# EAGLE design GPRS_Tracker_Sensors (EAGLE 8.1.0)

## Sheet 1 of 5
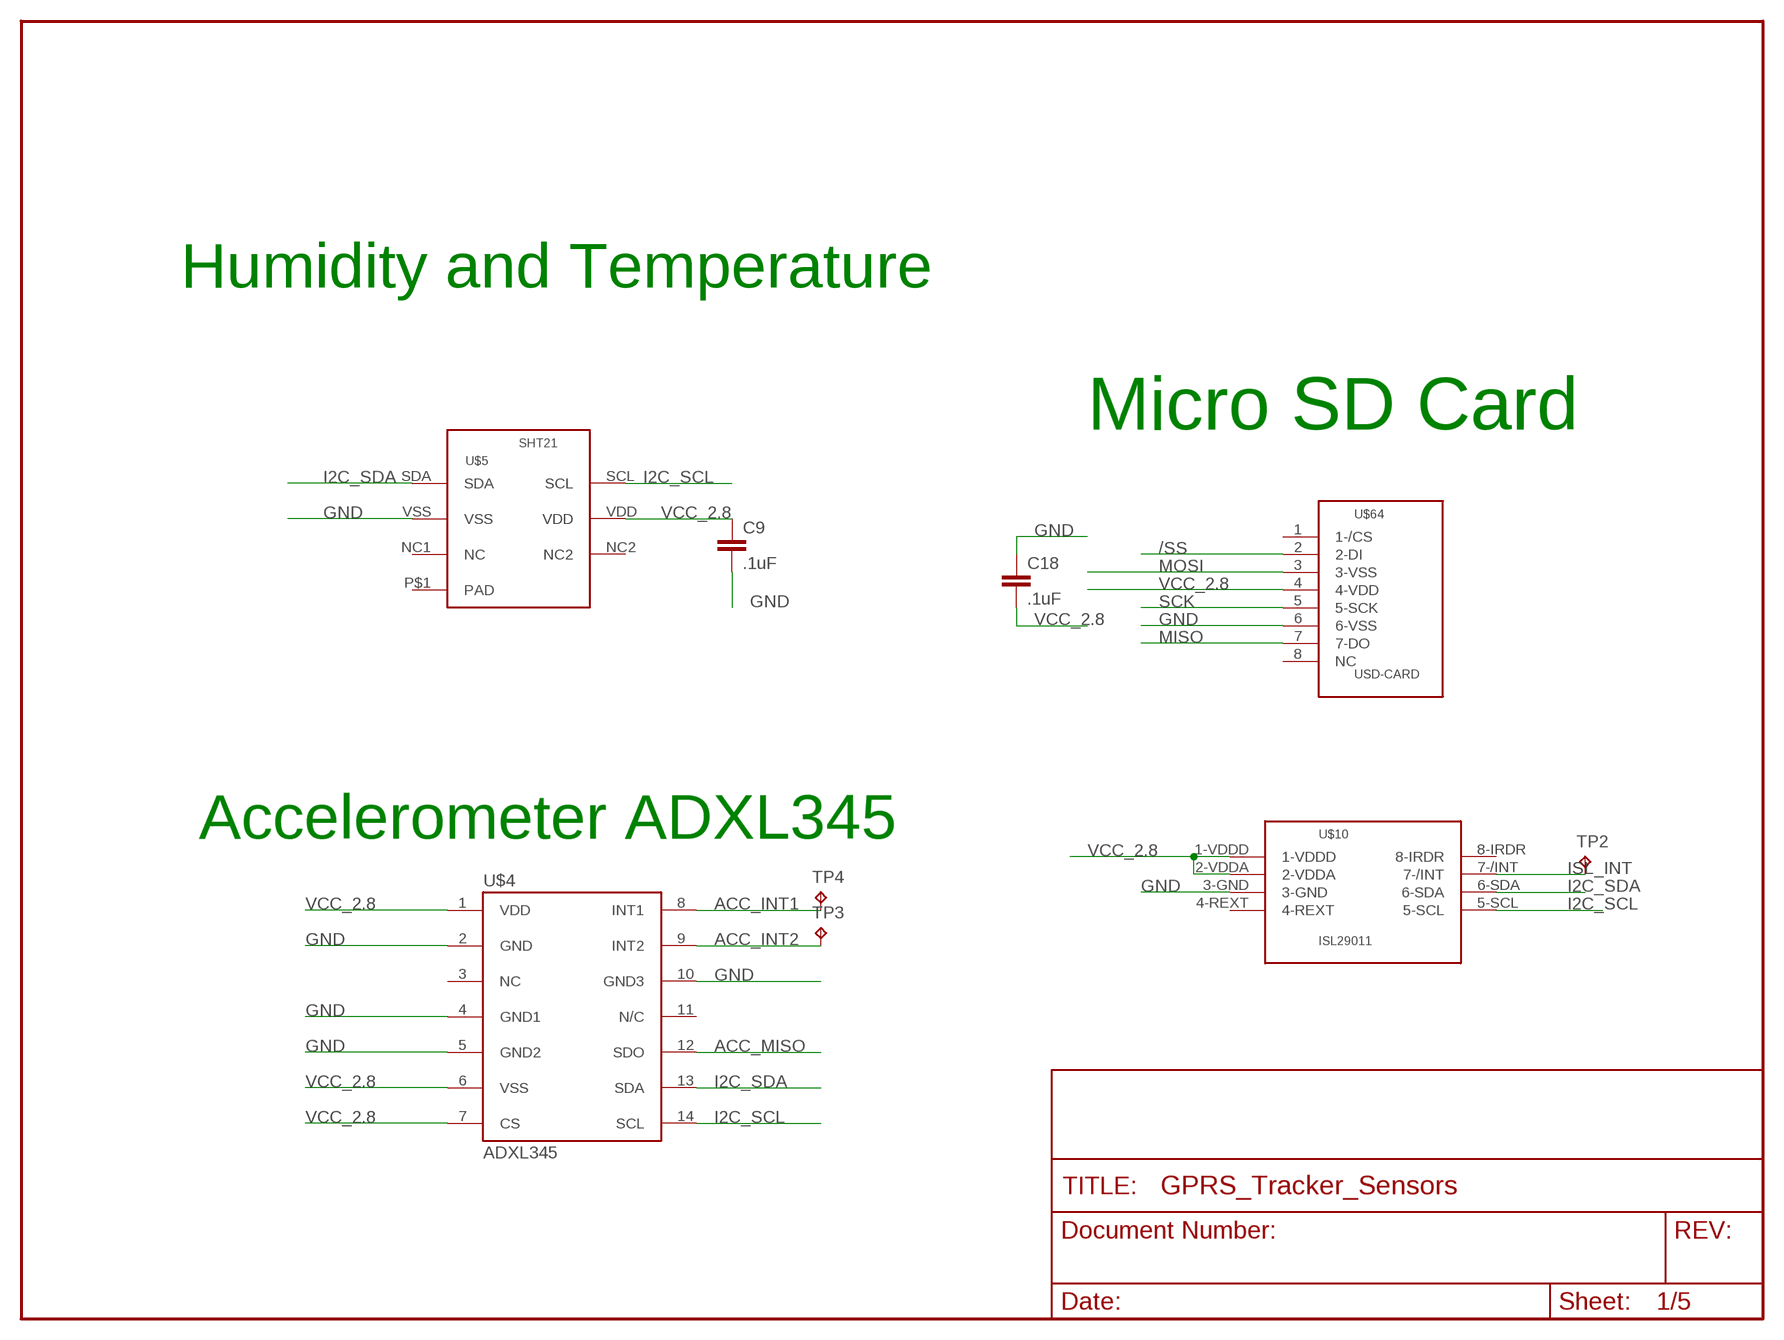
[diagram p0: schematic, sheet 1]

### Parts
C9  .1uF  C-EUC0402  [C0402]
C18  .1uF  C-EUC0402  [C0402]
TP2  TPTP08R  [TP08R]
TP3  TPTP06R  [TP06R]
TP4  TPTP06R  [TP06R]
U$4  ADXL345  [LGA14]
U$5  SHT21  [SHT21]
U$10  ISL29011  [ISL29011]
U$64  USD-CARD  [502774-0891]

### Nets
/SS: U$64.2(2-DI)
ACC_INT1: TP4.TP U$4.8(INT1)
ACC_INT2: TP3.TP U$4.9(INT2)
ACC_MISO: U$4.12(SDO)
GND: C9.2 C18.1 U$4.2(GND) U$4.4(GND1) U$4.5(GND2) U$4.10(GND3) U$5.VSS U$10.3-GND U$64.6(6-VSS) ; also sheet 2,5
I2C_SCL: U$4.14(SCL) U$5.SCL U$10.5-SCL
I2C_SDA: U$4.13(SDA) U$5.SDA U$10.6-SDA
ISL_INT: TP2.TP U$10.7-/INT
MISO: U$64.7(7-DO)
MOSI: U$64.3(3-VSS)
SCK: U$64.5(5-SCK)
VCC_2.8: C9.1 C18.2 U$4.1(VDD) U$4.6(VSS) U$4.7(CS) U$5.VDD U$10.1-VDDD U$10.2-VDDA U$64.4(4-VDD) ; also sheet 5
Unconnected: U$4.3(NC) U$4.11(N/C) U$5.NC1(NC) U$5.NC2 U$5.P$1(PAD) U$10.4-REXT U$10.8-IRDR U$64.1(1-/CS) U$64.8(NC)

### Notes on the sheet
- Humidity and Temperature
- Micro SD Card
- Accelerometer ADXL345

## Sheet 2 of 5
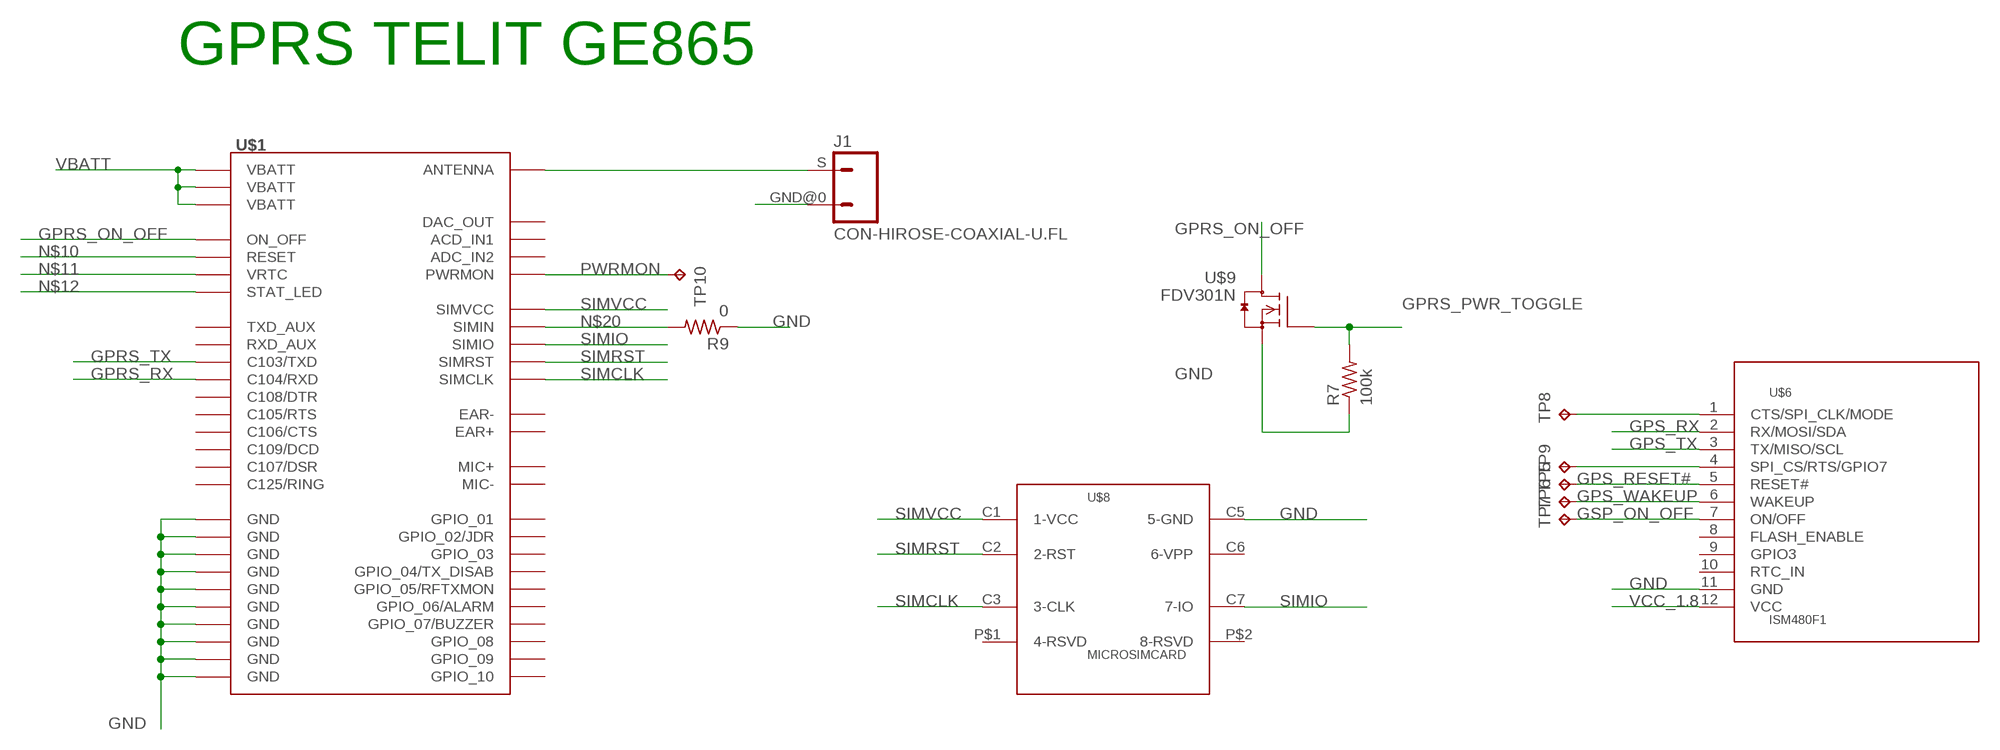
[diagram p1: schematic, sheet 2]

### Parts
J1  CON-HIROSE-COAXIAL-U.FL  [CON-U.FL]
R7  100k  R-US_R0402  [R0402]
R9  0  R-US_R0402  [R0402]
TP5  TPTP06R  [TP06R]
TP6  TPTP06R  [TP06R]
TP7  TPTP06R  [TP06R]
TP8  TPTP06R  [TP06R]
TP9  TPTP06R  [TP06R]
TP10  TPTP06R  [TP06R]
U$1  GE865  [GE865]
U$6  ISM480F1  [20488-012E-01]
U$8  MICROSIMCARD  [FMS006-5000-0]
U$9  FDV301N  [SOT23]

### Nets
GND: R7.1 R9.1 U$1.C2(GND) U$1.C7(GND) U$1.E5(GND) U$1.E7(GND) U$1.G1(GND) U$1.G3(GND) U$1.G4(GND) U$1.G5(GND) U$1.H3(GND) U$1.H6(GND) U$6.11(GND) U$8.C5(5-GND) U$9.2(S) ; also sheet 1,5
GPRS_ON_OFF: U$1.B1(ON_OFF) U$9.3(D)
GPRS_PWR_TOGGLE: R7.2 U$9.1(G)
GPRS_RX: U$1.A4(C104/RXD)
GPRS_TX: U$1.A3(C103/TXD)
GPS_RESET#: TP5.TP U$6.5(RESET#)
GPS_RX: U$6.2(RX/MOSI/SDA)
GPS_TX: U$6.3(TX/MISO/SCL)
GPS_WAKEUP: TP6.TP U$6.6(WAKEUP)
GSP_ON_OFF: TP7.TP U$6.7(ON/OFF)
N$7: J1.S U$1.H5(ANTENNA)
N$8: J1.GND@0
N$9: TP8.TP U$6.1(CTS/SPI_CLK/MODE)
N$10: U$1.C1(RESET)
N$11: U$1.H2(VRTC)
N$12: U$1.G8(STAT_LED)
N$13: TP9.TP U$6.4(SPI_CS/RTS/GPIO7)
N$20: R9.2 U$1.B7(SIMIN)
PWRMON: TP10.TP U$1.E2(PWRMON)
SIMCLK: U$1.A5(SIMCLK) U$8.C3(3-CLK)
SIMIO: U$1.A6(SIMIO) U$8.C7(7-IO)
SIMRST: U$1.A8(SIMRST) U$8.C2(2-RST)
SIMVCC: U$1.A7(SIMVCC) U$8.C1(1-VCC)
VBATT: U$1.F1(VBATT) U$1.F2(VBATT) U$1.F3(VBATT) ; also sheet 5
VCC_1.8: U$6.12(VCC) ; also sheet 5
Unconnected: U$1.A1(C105/RTS) U$1.A2(C106/CTS) U$1.B2(C107/DSR) U$1.B3(C108/DTR) U$1.B4(C125/RING) U$1.B5(C109/DCD) U$1.B8(MIC+) U$1.C8(MIC-) U$1.D1(TXD_AUX) U$1.D2(GPIO_02/JDR) U$1.D3(GPIO_01) U$1.D4(GPIO_08) U$1.D8(EAR+) U$1.E1(RXD_AUX) U$1.E3(GPIO_10) U$1.E4(GPIO_03) U$1.E8(EAR-) U$1.F4(GPIO_09) U$1.F5(ACD_IN1) U$1.F6(ADC_IN2) U$1.G2(GPIO_05/RFTXMON) U$1.G6(GPIO_07/BUZZER) U$1.G7(DAC_OUT) U$1.H7(GPIO_04/TX_DISAB) U$1.H8(GPIO_06/ALARM) U$6.8(FLASH_ENABLE) U$6.9(GPIO3) U$6.10(RTC_IN) U$8.C6(6-VPP) U$8.P$1(4-RSVD) U$8.P$2(8-RSVD)

### Notes on the sheet
- GPRS TELIT GE865

## Sheet 3 of 5

## Sheet 4 of 5

## Sheet 5 of 5
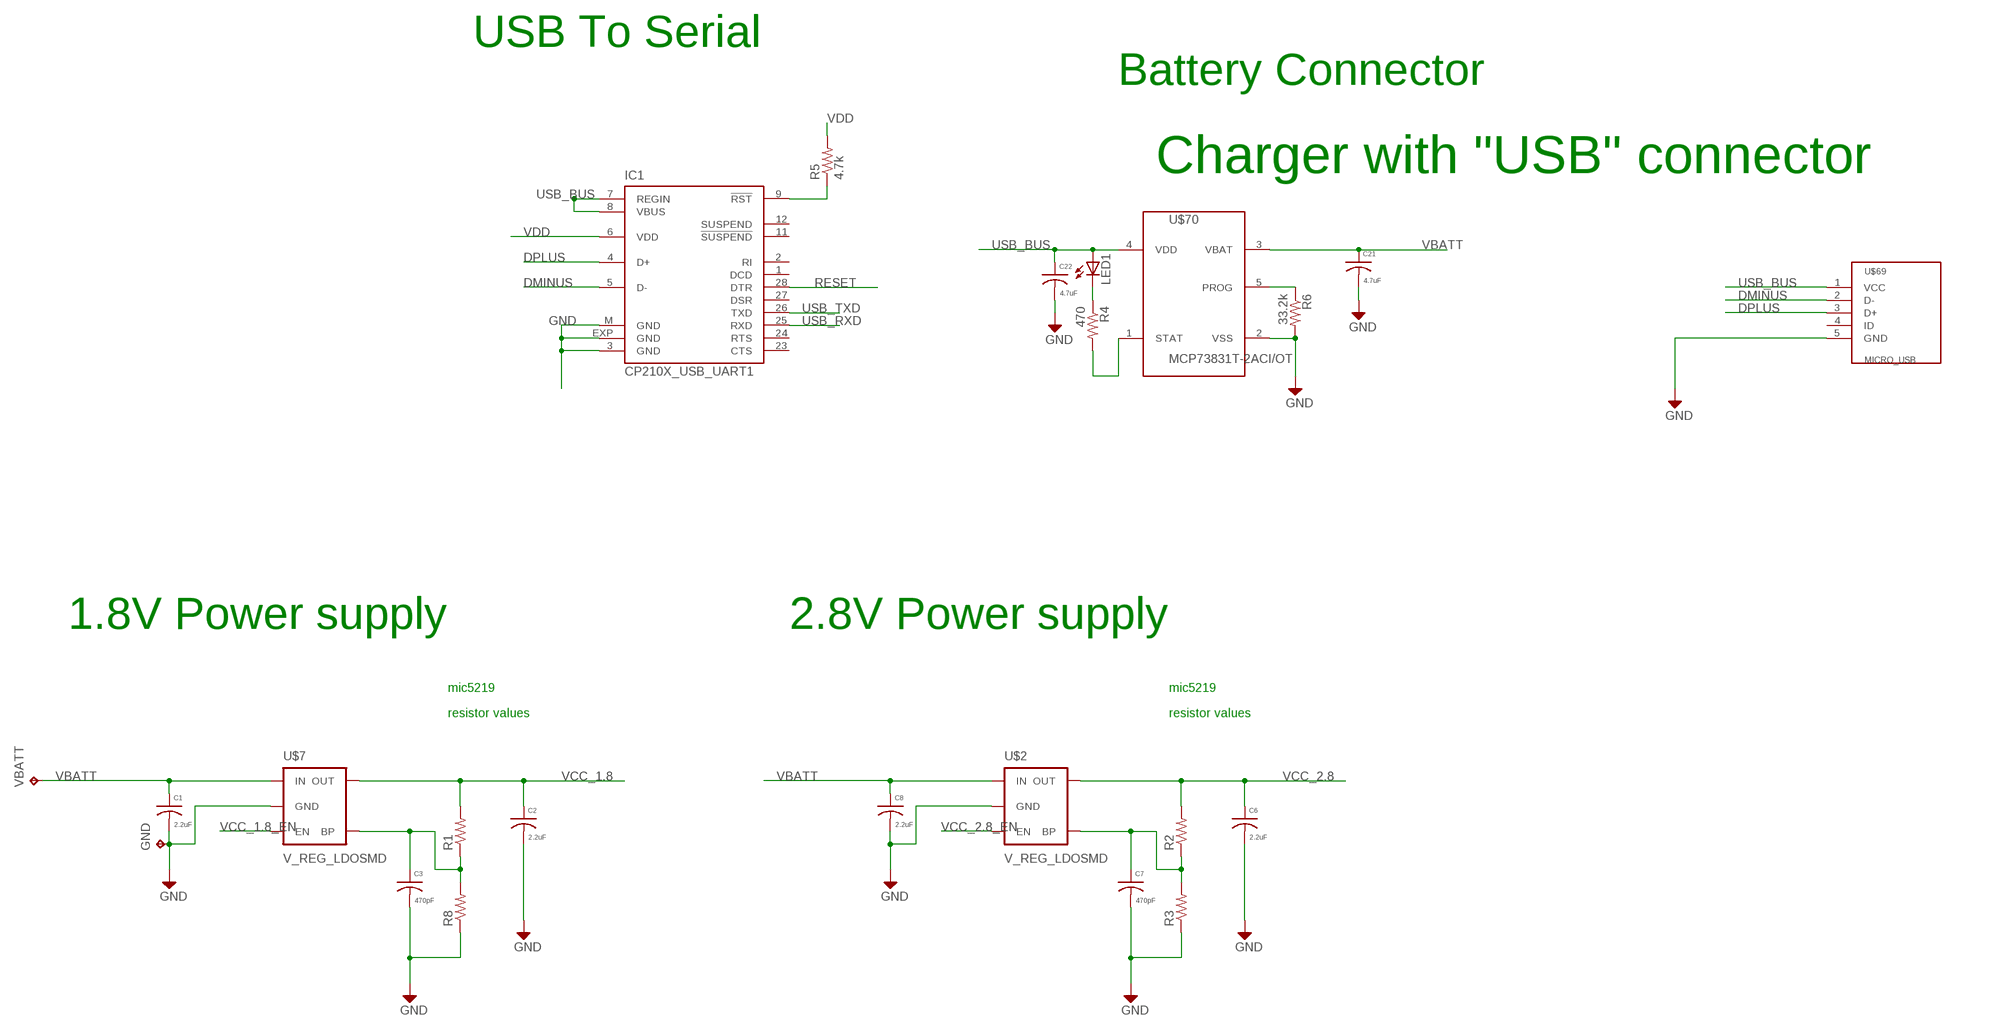
[diagram p2: schematic, sheet 5]

### Parts
C1  2.2uF  C0603  [C0603]
C2  2.2uF  C0603  [C0603]
C3  470pF  C0402  [C0402]
C6  2.2uF  C0603  [C0603]
C7  470pF  C0402  [C0402]
C8  2.2uF  C0603  [C0603]
C21  4.7uF  C0603  [C0603]
C22  4.7uF  C0603  [C0603]
GND  TPTP15R  [TP15R]
IC1  CP210X_USB_UART1  [MLP28]
LED1  LEDCHIP-LED0603  [CHIP-LED0603]
R1  R-US_R0402  [R0402]
R2  R-US_R0402  [R0402]
R3  R-US_R0402  [R0402]
R4  470  R-US_R0402  [R0402]
R5  4.7k  R-US_R0402  [R0402]
R6  33.2k  R-US_R0402  [R0402]
R8  R-US_R0402  [R0402]
U$2  V_REG_LDOSMD  [SOT23-5]
U$7  V_REG_LDOSMD  [SOT23-5]
U$69  MICRO_USB  [MICRO_USB]
U$70  MCP73831T-2ACI/OT  [SOT23-5L]
VBATT  TPTP15R  [TP15R]

### Nets
CHG_STAT: R4.2 U$70.1(STAT)
DMINUS: IC1.5(D-) U$69.2(D-)
DPLUS: IC1.4(D+) U$69.3(D+)
GND: C1.2 C2.2 C3.2 C6.2 C7.2 C8.2 C21.2 C22.2 GND.TP IC1.3(GND) IC1.EXP(GND) IC1.M(GND) R3.1 R6.2 R8.1 U$2.2(GND) U$7.2(GND) U$69.5(GND) U$70.2(VSS) ; also sheet 1,2
N$1: C3.1 R1.1 R8.2 U$7.4(BP)
N$2: C7.1 R2.1 R3.2 U$2.4(BP)
N$4: IC1.9(!RST) R5.1
N$40: LED1.C R4.1
N$41: R6.1 U$70.5(PROG)
RESET: IC1.28(DTR)
USB_BUS: C22.1 IC1.7(REGIN) IC1.8(VBUS) LED1.A U$69.1(VCC) U$70.4(VDD)
USB_RXD: IC1.25(RXD)
USB_TXD: IC1.26(TXD)
VBATT: C1.1 C8.1 C21.1 U$2.1(IN) U$7.1(IN) U$70.3(VBAT) VBATT.TP ; also sheet 2
VCC_1.8: C2.1 R1.2 U$7.5(OUT) ; also sheet 2
VCC_1.8_EN: U$7.3(EN)
VCC_2.8: C6.1 R2.2 U$2.5(OUT) ; also sheet 1
VCC_2.8_EN: U$2.3(EN)
VDD: IC1.6(VDD) R5.2
Unconnected: IC1.1(DCD) IC1.2(RI) IC1.11(!SUSPEND) IC1.12(SUSPEND) IC1.23(CTS) IC1.24(RTS) IC1.27(DSR) U$69.4(ID)

### Notes on the sheet
- USB To Serial
- Battery Connector
- Charger with "USB" connector
- 1.8V Power supply | 2.8V Power supply
- mic5219 | mic5219
- resistor values | resistor values

## Library data of the parts
C1-C3 C6-C8 C21 C22 = qualified_1:C
C9 C18 = rcl:C-EU: CAPACITOR, European symbol
GND TP2-TP10 VBATT = testpad:TP: Test pad
IC1 = SparkFun-3-2-07:CP210X_USB_UART: Single-Chip USB to UART Bridge Source: www.silabs.com .. CP2101.pdf / cp2102.pdf. Spark Fun Electronics SKU : IC-CP2102
J1 = m-pad-2.1:CON-HIROSE-COAXIAL: Hirose SMT 50 ohm impedance connector W.FL ............................. 1.4mm mated height, ultra small SMT connectors .................................. DC to 3GHz U.FL .............................. 1.9mm or 2.4mm mated height, ultra small SMT connectors ................... DC to 6GHz E.FL ............................... 3.2mm mated height, ultra small SMT connectors .................................. DC to 2GHz H.FL .............................. 3.0mm mated height, ultra small SMT connectors ................................... DC to 3GHz S.FL. ............................. 6.0mm mated height, SMT connectors ................................................... DC to 2.5GHz FL ................................. 10.5mm mated height, SMT connectors .................................................. DC to 1.5GHz Please send any comments to: messi@users.sourceforge.net
LED1 = led:LED: LED OSRAM: - CHIPLED LG R971, LG N971, LY N971, LG Q971, LY Q971, LO R971, LY R971 LH N974, LH R974 LS Q976, LO Q976, LY Q976 LO Q996 - Hyper CHIPLED LW Q18S LB Q993, LB Q99A, LB R99A - SideLED LS A670, LO A670, LY A670, LG A670, LP A670 LB A673, LV A673, LT A673, LW A673 LH A674 LY A675 LS A676, LA A676, LO A676, LY A676, LW A676 LS A679, LY A679, LG A679 - Hyper Micro SIDELED® LS Y876, LA Y876, LO Y876, LY Y876 LT Y87S - SmartLED LW L88C, LW L88S LB L89C, LB L89S, LG L890 LS L89K, LO L89K, LY L89K LS L896, LA L896, LO L896, LY L896 - TOPLED LS T670, LO T670, LY T670, LG T670, LP T670 LSG T670, LSP T670, LSY T670, LOP T670, LYG T670 LG T671, LOG T671, LSG T671 LB T673, LV T673, LT T673, LW T673 LH T674 LS T676, LA T676, LO T676, LY T676, LB T676, LH T676, LSB T676, LW T676 LB T67C, LV T67C, LT T67C, LS T67K, LO T67K, LY T67K, LW E67C LS E67B, LA E67B, LO E67B, LY E67B, LB E67C, LV E67C, LT E67C LW T67C LS T679, LY T679, LG T679 LS T770, LO T770, LY T770, LG T770, LP T770 LB T773, LV T773, LT T773, LW T773 LH T774 LS E675, LA E675, LY E675, LS T675 LS T776, LA T776, LO T776, LY T776, LB T776 LHGB T686 LT T68C, LB T68C - Hyper Mini TOPLED® LB M676 - Mini TOPLED Santana® LG M470 LS M47K, LO M47K, LY M47K Source: http://www.osram.convergy.de LUXEON: - LUMILED® LXK2-PW12-R00, LXK2-PW12-S00, LXK2-PW14-U00, LXK2-PW14-V00 LXK2-PM12-R00, LXK2-PM12-S00, LXK2-PM14-U00 LXK2-PE12-Q00, LXK2-PE12-R00, LXK2-PE12-S00, LXK2-PE14-T00, LXK2-PE14-U00 LXK2-PB12-K00, LXK2-PB12-L00, LXK2-PB12-M00, LXK2-PB14-N00, LXK2-PB14-P00, LXK2-PB14-Q00 LXK2-PR12-L00, LXK2-PR12-M00, LXK2-PR14-Q00, LXK2-PR14-R00 LXK2-PD12-Q00, LXK2-PD12-R00, LXK2-PD12-S00 LXK2-PH12-R00, LXK2-PH12-S00 LXK2-PL12-P00, LXK2-PL12-Q00, LXK2-PL12-R00 Source: www.luxeon.com KINGBRIGHT: KA-3528ASYC Source: www.kingbright.com
R1-R6 R8 = rcl:R-US_: RESISTOR, American symbol
R7 R9 = resistor:R-US_: RESISTOR, American symbol
U$1 = SparkFun:GE865
U$2 U$7 = SparkFun-3-2-07:V_REG_LDO: Voltage Regulator LDO Standard 150mA LDO voltage regulator in SOT-23 layout. Micrel part MIC5205. BP (by-pass) pin is used to lower output noise with 470pF cap.
U$4 = SparkFun:ADXL345
U$5 = m-pad-2.1:SHT21
U$6 = m-pad-2.1:ISM480F1
U$8 = m-pad-2.1:MICROSIMCARD
U$9 = m-pad-2.1:FDV301N
U$10 = m-pad-2.1:ISL29011
U$64 = m-pad-2.1:USD-CARD
U$69 = camera_project:MICRO_USB
U$70 = m-pad-2.1:MCP73831T-2ACI/OT

## Net classes
1 supply: width 0.229 mm

## Board
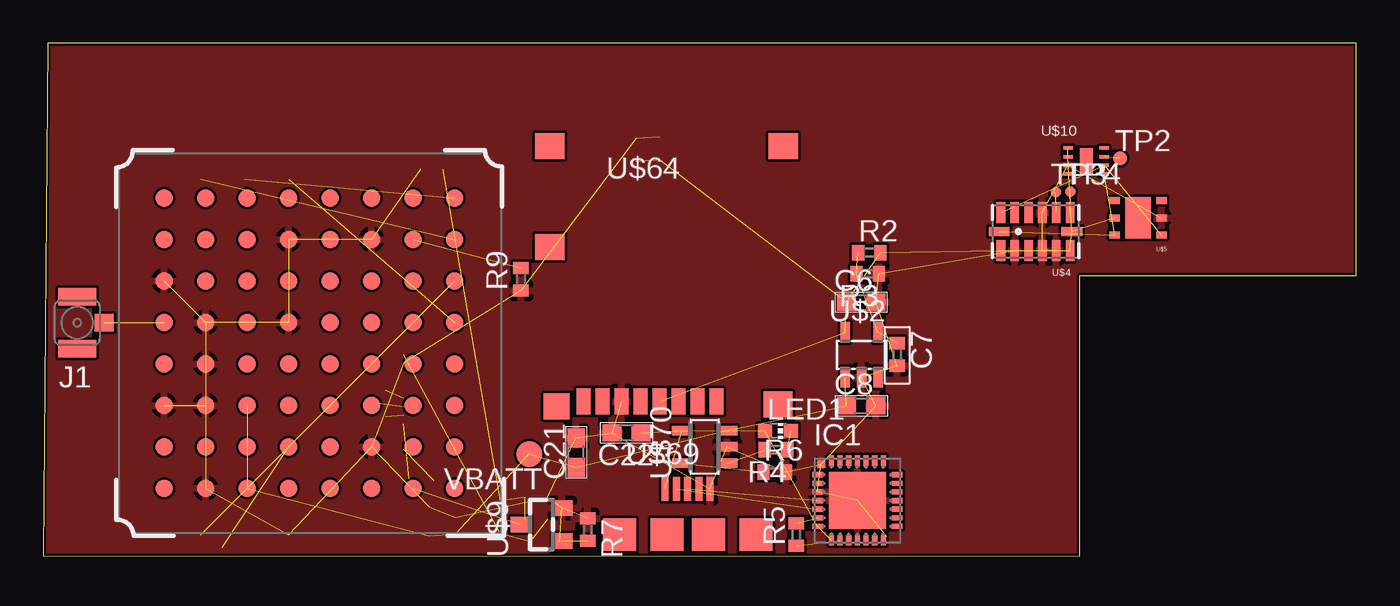
[diagram p3: board, top side]
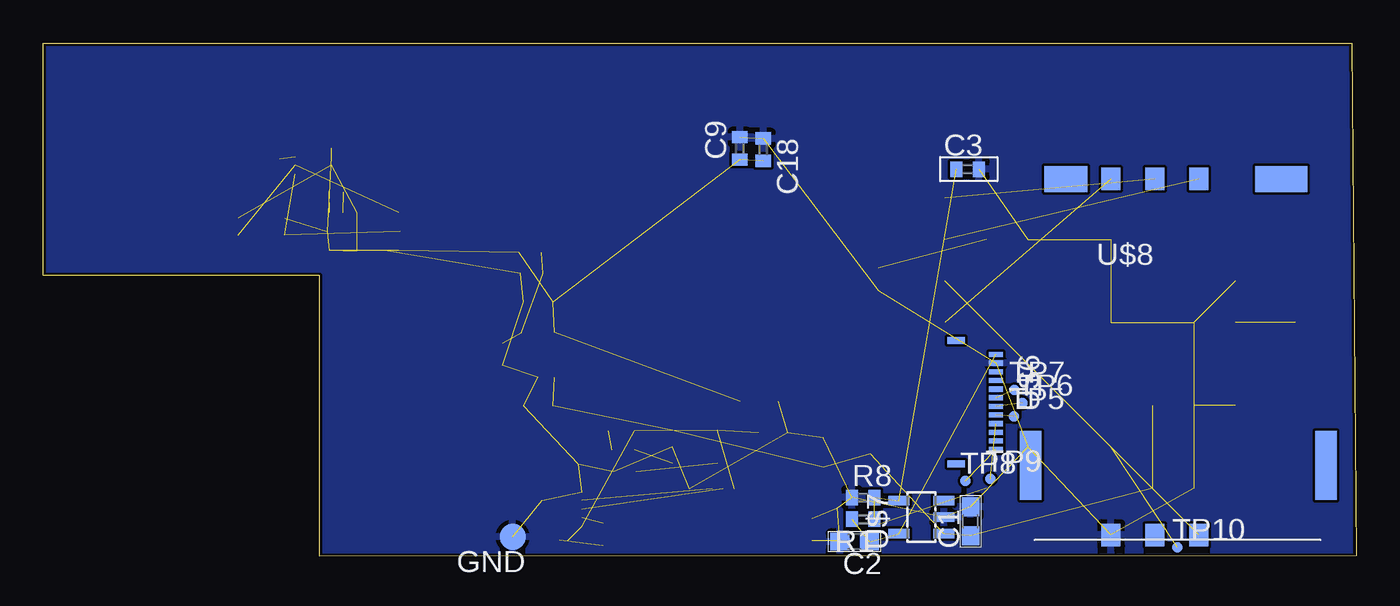
[diagram p4: board, bottom side, seen from below]

Size 75.94 x 29.68 mm. Coordinates in mm from the lower left corner, seen from the top.
Outline: 0,0.02 59.94,0 59.94,16.23 75.94,16.23 75.94,29.68 0.27,29.68 0,0.02
Copper layers (1*16): Top 0.035mm / dielectric 1.5mm / Bottom 0.035mm
Design rules "SparkFun *": minimum track width 6mil, minimum drill 6mil, track to track 6mil, track to pad 6mil, pad to pad 6mil, via to via 6mil, smd to smd 6mil, copper to edge 6mil, drill to drill 6mil, minimum pad ring 12mil, minimum via ring 10mil, stop-mask expansion 4mil, vias tented up to drill 20mil, thermal gap 10mil

### Footprints (pad centres in the part's own frame; a part is rotated, then mirrored left to right if it is on the bottom)
C0603 = smd 1.1 x 1: 1 -0.85,0; 2 0.85,0
C0402 = smd 0.7 x 0.9: 1 -0.65,0; 2 0.65,0
TP15R = smd 1.5 x 1.5: TP 0,0
MLP28 = smd 0.6 x 0.3: 1 -2.3,1.5; 2 -2.3,1; 3 -2.3,0.5; 4 -2.3,0; 5 -2.3,-0.5; 6 -2.3,-1; 7 -2.3,-1.5; 15 2.3,-1.5; 16 2.3,-1; 17 2.3,-0.5; 18 2.3,0; 19 2.3,0.5; 20 2.3,1; 21 2.3,1.5 | smd 0.3 x 0.6: 8 -1.5,-2.3; 9 -1,-2.3; 10 -0.5,-2.3; 11 0,-2.3; 12 0.5,-2.3; 13 1,-2.3; 14 1.5,-2.3; 22 1.5,2.3; 23 1,2.3; 24 0.5,2.3; 25 0,2.3; 26 -0.5,2.3; 27 -1,2.3; 28 -1.5,2.3 | smd 3.3 x 3.3: EXP 0,0 | smd 0.435 x 0.435: M -2.103,2.103
CON-U.FL = smd 1 x 2.2: GND@0 -1.5,0; GND@1 1.5,0 | smd 1 x 1.1: S 0,-1.55
CHIP-LED0603 = smd 0.8 x 0.8: A 0,-0.75; C 0,0.75
R0402 = smd 0.7 x 0.9: 1 -0.65,0; 2 0.65,0
TP08R = smd 0.8 x 0.8: TP 0,0
TP06R = smd 0.6 x 0.6: TP 0,0
GE865 = smd 1 x 1: A1 -8.4,8.4; A2 -8.4,6; A3 -8.4,3.6; A4 -8.4,1.2; A5 -8.4,-1.2; A6 -8.4,-3.6; A7 -8.4,-6; A8 -8.4,-8.4; B1 -6,8.4; B2 -6,6; B3 -6,3.6; B4 -6,1.2; B5 -6,-1.2; B6 -6,-3.6; B7 -6,-6; B8 -6,-8.4; C1 -3.6,8.4; C2 -3.6,6; C3 -3.6,3.6; C4 -3.6,1.2; C5 -3.6,-1.2; C6 -3.6,-3.6; C7 -3.6,-6; C8 -3.6,-8.4; D1 -1.2,8.4; D2 -1.2,6; D3 -1.2,3.6; D4 -1.2,1.2; D5 -1.2,-1.2; D6 -1.2,-3.6; D7 -1.2,-6; D8 -1.2,-8.4; E1 1.2,8.4; E2 1.2,6; E3 1.2,3.6; E4 1.2,1.2; E5 1.2,-1.2; E6 1.2,-3.6; E7 1.2,-6; E8 1.2,-8.4; F1 3.6,8.4; F2 3.6,6; F3 3.6,3.6; F4 3.6,1.2; F5 3.6,-1.2; F6 3.6,-3.6; F7 3.6,-6; F8 3.6,-8.4; G1 6,8.4; G2 6,6; G3 6,3.6; G4 6,1.2; G5 6,-1.2; G6 6,-3.6; G7 6,-6; G8 6,-8.4; H1 8.4,8.4; H2 8.4,6; H3 8.4,3.6; H4 8.4,1.2; H5 8.4,-1.2; H6 8.4,-3.6; H7 8.4,-6; H8 8.4,-8.4
SOT23-5 = smd 0.55 x 1.2: 1 -0.95,-1.3; 2 0,-1.3; 3 0.95,-1.3; 4 0.95,1.3; 5 -0.95,1.3
LGA14 = smd 0.5 x 1.2: 1 2,1.1; 2 1.2,1.1; 3 0.4,1.1; 4 -0.4,1.1; 5 -1.2,1.1; 6 -2,1.1; 8 -2,-1.1; 9 -1.2,-1.1; 10 -0.4,-1.1; 11 0.4,-1.1; 12 1.2,-1.1; 13 2,-1.1 | smd 1.2 x 0.5: 7 -2.1,0; 14 2.1,0
SHT21 = smd 0.6 x 0.4: NC1 -1.35,-1; NC2 1.35,-1; SCL 1.35,1; SDA -1.35,1; VDD 1.35,0; VSS -1.35,0 | smd 1.5 x 2.4: P$1 0,0
20488-012E-01 = smd 0.3 x 0.8: 1 5.5,0; 2 5,0; 3 4.5,0; 4 4,0; 5 3.5,0; 6 3,0; 7 2.5,0; 8 2,0; 9 1.5,0; 10 1,0; 11 0.5,0; 12 0,0 | smd 0.4 x 1: P$13 -0.825,-2.3; P$14 6.325,-2.3
FMS006-5000-0 = smd 1.1 x 1.3: C1 7.68,0; C2 5.14,0; C3 2.6,0; C5 2.6,-20.6; C6 5.14,-20.6; C7 7.68,-20.6 | smd 2.5 x 1.5: P$1 0,0 | smd 3 x 1.5: P$2 12.45,0 | smd 1.25 x 4: P$3 -2.05,-16.58; P$4 15.05,-16.58
SOT23 = smd 0.9 x 1.2: 1 -0.95,-1.2; 2 0.95,-1.2; 3 0,1.2
ISL29011 = smd 0.55 x 0.2: 1-VDDD -1.05,0; 2-VDDA -1.05,-0.5; 3-GND -1.05,-1; 4-REXT -1.05,-1.5; 5-SCL 1.05,-1.5; 6-SDA 1.05,-1; 7-/INT 1.05,-0.5; 8-IRDR 1.05,0 | smd 0.75 x 1.5: P$1 0,-0.76
502774-0891 = smd 0.8 x 1.5: 1 2.9,-15.61; 2 1.8,-15.61; 3 0.7,-15.61; 4 -0.4,-15.61; 5 -1.5,-15.61; 6 -2.6,-15.61; 7 -3.7,-15.61; 8 -4.8,-15.61 | smd 1.7 x 1.5: P$1 -6.75,-0.85; P$2 6.75,-0.85; P$3 -6.75,-6.7; P$12 6.45,-15.79 | smd 1.5 x 1.5: P$13 -6.346,-15.898
MICRO_USB = smd 0.4 x 1.4: 1 -1.3,0; 2 -0.65,0; 3 0,0; 4 0.65,0; 5 1.3,0 | smd 1.9 x 1.9: P$6 3.95,-2.65; P$7 -3.95,-2.65; P$8 -1.2,-2.65; P$9 1.2,-2.65
SOT23-5L = smd 0.55 x 1.2: 1 -0.95,-1.3; 2 0,-1.3; 3 0.95,-1.3; 4 0.95,1.3; 5 -0.95,1.3

### Placement (x,y rotation side)
C1  22.31,2.01 90 bottom
C2  29.02,0.84 180 bottom
C3  22.47,22.39 0 bottom
C6  47.31,14.69 0 top
C7  49.39,11.67 270 top
C8  47.32,8.7 0 top
C9  35.66,23.59 90 bottom
C18  34.3,23.52 270 bottom
C21  30.83,6 90 top
C22  33.74,7.14 180 top
GND  48.79,1.12 180 bottom
IC1  47.09,3.22 0 top
J1  1.97,13.51 90 top
LED1  42.49,7.25 270 top
R1  28.52,2.14 180 bottom
R2  47.78,17.56 0 top
R3  47.69,16.35 180 top
R4  42.38,6.16 180 top
R5  43.55,1.25 90 top
R6  42.31,4.87 0 top
R7  31.49,1.53 270 top
R8  28.52,3.39 0 bottom
R9  27.63,16.02 90 top
TP2  62.28,23.01 0 top
TP3  58.57,21.07 0 top
TP4  59.4,21.09 0 top
TP5  19.81,8.09 0 bottom
TP6  19.31,8.86 0 bottom
TP7  19.78,9.61 0 bottom
TP8  22.61,4.35 0 bottom
TP9  21.15,4.47 0 bottom
TP10  10.34,0.51 0 bottom
U$1  15.39,12.33 180 top
U$2  47.33,11.66 0 top
U$4  57.39,18.78 180 top
U$5  63.32,19.57 180 top
U$6  20.84,11.67 270 bottom
U$7  25.15,2.26 90 bottom
U$8  16.79,21.83 0 bottom
U$9  28.82,1.83 90 top
U$10  60.32,23.62 0 top
U$64  36.04,24.58 0 top
U$69  37.27,3.9 0 top
U$70  38.26,6.33 90 top
VBATT  28.1,5.91 180 top

### Tracks (layer width: path | path; a pad name or v marks a point on that pad's centre or on a via)
ACC_INT1  (1 unrouted)
ACC_INT2  (1 unrouted)
CHG_STAT  (1 unrouted)
DMINUS  (1 unrouted)
DPLUS  (1 unrouted)
GND  (42 unrouted)
  pour Top: 0.39,29.68 75.94,29.68 75.94,-0.15 0.33,-0.15 0.33,24
  pour Bottom: 0.45,29.68 75.94,29.68 75.94,-0.38 0.39,-0.38 0.39,23.6
GPRS_ON_OFF  (1 unrouted)
GPRS_PWR_TOGGLE  (1 unrouted)
GPS_RESET#  (1 unrouted)
GPS_WAKEUP  (1 unrouted)
GSP_ON_OFF  (1 unrouted)
I2C_SCL  (2 unrouted)
I2C_SDA  (2 unrouted)
ISL_INT  (1 unrouted)
N$1  (3 unrouted)
N$2  (3 unrouted)
N$4  (1 unrouted)
N$7  (1 unrouted)
N$9  (1 unrouted)
N$13  (1 unrouted)
N$20  (1 unrouted)
N$40  (1 unrouted)
N$41  (1 unrouted)
PWRMON  (1 unrouted)
SIMCLK  (1 unrouted)
SIMIO  (1 unrouted)
SIMRST  (1 unrouted)
SIMVCC  (1 unrouted)
USB_BUS  (5 unrouted)
VBATT  (9 unrouted)
VCC_1.8  (3 unrouted)
VCC_2.8  (11 unrouted)
VDD  (1 unrouted)